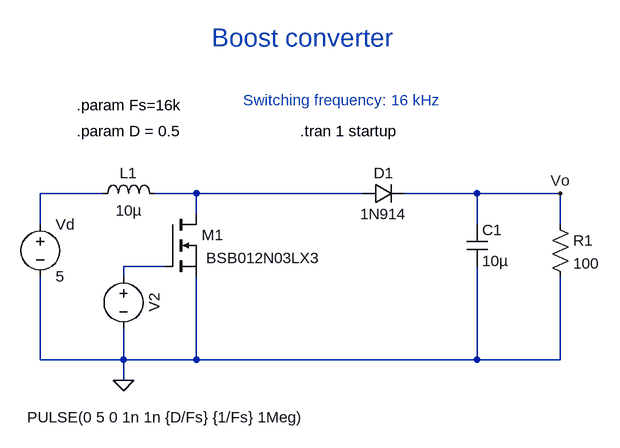
[diagram p0: schematic Boost-converter-3.asc]
Boost-converter-3.asc, the LTspice schematic file:
Version 4.1
SHEET 1 1244 680
WIRE -80 96 -176 96
WIRE 64 96 0 96
WIRE 320 96 64 96
WIRE 496 96 384 96
WIRE 624 96 496 96
WIRE 64 128 64 96
WIRE -176 144 -176 96
WIRE 496 144 496 96
WIRE 624 144 624 96
WIRE 16 208 -48 208
WIRE -48 224 -48 208
WIRE -176 352 -176 224
WIRE -48 352 -48 304
WIRE -48 352 -176 352
WIRE 64 352 64 224
WIRE 64 352 -48 352
WIRE 496 352 496 208
WIRE 496 352 64 352
WIRE 624 352 624 224
WIRE 624 352 496 352
WIRE -48 384 -48 352
FLAG 624 96 Vo
FLAG -48 384 0
SYMBOL voltage -176 128 R0
WINDOW 123 0 0 Left 0
WINDOW 39 0 0 Left 0
SYMATTR InstName Vd
SYMATTR Value 5
SYMBOL diode 320 112 R270
WINDOW 0 32 32 VTop 2
WINDOW 3 0 32 VBottom 2
SYMATTR InstName D1
SYMATTR Value 1N914
SYMBOL ind -96 112 R270
WINDOW 0 32 56 VTop 2
WINDOW 3 5 56 VBottom 2
SYMATTR InstName L1
SYMATTR Value 10µ
SYMATTR SpiceLine Ipk=0.39 Rser=0.72 Rpar=0 Cpar=0
SYMBOL cap 480 144 R0
SYMATTR InstName C1
SYMATTR Value 10µ
SYMBOL res 608 128 R0
SYMATTR InstName R1
SYMATTR Value 100
SYMBOL voltage -48 208 R0
WINDOW 0 32 56 VTop 2
WINDOW 3 66 248 Bottom 2
WINDOW 123 0 0 Left 0
WINDOW 39 0 0 Left 0
SYMATTR InstName V2
SYMATTR Value PULSE(0 5 0 1n 1n {D/Fs} {1/Fs} 1Meg)
SYMBOL nmos 16 128 R0
WINDOW 3 63 67 Left 2
SYMATTR InstName M1
SYMATTR Value BSB012N03LX3
TEXT 224 0 Left 2 !.tran 1 startup
TEXT 88 -144 Left 4 ;Boost converter
TEXT -120 -40 Left 2 !.param Fs=16k
TEXT -120 0 Left 2 !.param D = 0.5
TEXT 136 -48 Left 2 ;Switching frequency: 16 kHz

The netlist it stands for:
* Boost-converter-3.asc
Vd N001 0 5
D1 N002 Vo 1N914
L1 N001 N002 10µ Ipk=0.39 Rser=0.72 Rpar=0 Cpar=0
C1 Vo 0 10µ
R1 Vo 0 100
V2 N003 0 PULSE(0 5 0 1n 1n {D/Fs} {1/Fs} 1Meg)
M1 N002 N003 0 0 BSB012N03LX3
.model D D
.lib standard.dio
.model NMOS NMOS
.model PMOS PMOS
.lib standard.mos
.tran 1 startup
* Boost converter
.param Fs=16k
.param D = 0.5
* Switching frequency: 16 kHz
.backanno
.end